# Altium schematic sheet ConnMotor.SchDoc
size A
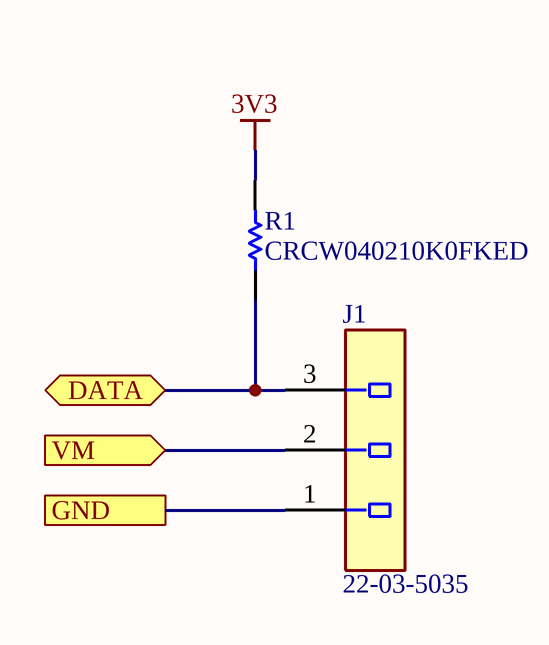
[diagram p0: ConnMotor.SchDoc]

## Parts
J1  Part Number: 22-03-5035  [Molex_22-03-5035_0]  (hidden comment: Conn_Molex_22-03-5035_eec)
R1  CRCW040210K0FKED  [RESC1005X40X25NL05T05]

## Ports
DATA (bidir), GND, VM (in)

## Nets
3V3: R1.2
DATA: J1.3 R1.1 ; port DATA
GND: J1.1 ; port GND
VM: J1.2 ; port VM

## Library data of the parts
J1 = Conn_Molex_22-03-5035_eec: CONN 3 Positions Header Connector 0.098" (2.50mm) Through Hole Tin; Manufacturer: Molex; Num Pins: 3; Category E7012A0Bd22E3Cc6: Headers & Receptacles; pin_pitch: 2.5mm; shrouded: Yes; glow_wire_compliant: Non-Compliant; size_length: 9.9mm; contact_material: Brass; voltage_rating_ac: 250V; number_of_rows: 1; Category 75Fab8F04590Ae3D: Connectors and Adapters; contact_resistance: 20mΩ; size_width: 4.9mm; gender: Female; current_rating: 3A; size_height: 5.9mm; insulation_resistance: 1GΩ; Category 0836C53C3D42D3F1: Connectors; helpURL: https://upverter.com/upn/revision/5f4eec58f2a5589a/; ComponentLink2Description: Datasheet; Temperature: -40°C to +105°C; Package: CONN_PTH_HDR3; Supplier 2: Mouser; Price: 0.362417304973; Supplier 1: Digi-Key; ComponentLink1URL: https://upverter.com/upn/revision/5f4eec58f2a5589a/; Supplier Part Number 2: 538-22-03-5035; Supplier Part Number 1: WM18887-ND; ComponentLink1Description: Upverter; ComponentLink2URL: http://www.molex.com/pdm_docs/sd/022035035_sd.pdf; RoHS: TRUE; Mouser Part Number: 538-22-03-5035; orientation: Vertical; number_of_circuits: 3; lifecycle_status: Active; Temperature Range High: +105°C; number_of_contacts: 3; Temperature Range Low: -40°C; Digikey Part Number: WM18887-ND; contact_plating: Tin; voltage_rating_dc: 250V; Lead Free: yes; flammability_rating: UL 94 V-0; halogen_free_status: Not Low Halogen; Digikey Description: CONN 3 Positions Header Connector 0.098" (2.50mm) Through Hole Tin; number_of_positions: 3; Mounting Type: pcb; Octopart Part Number: 2021e92f3fb6ffe6
R1 = CMP-2002-08135-1: Manufacturer: Vishay Dale; Part Number: CRCW040210K0FKED